# Altium schematic sheet STM32H7_POWER_MISCELLANEOUS.SchDoc
size A; Organization: Altium Limited; Address1: L3, 12a Rodborough Rd; Address2: Frenchs Forest; Address3: NSW; Address4: Australia 2086
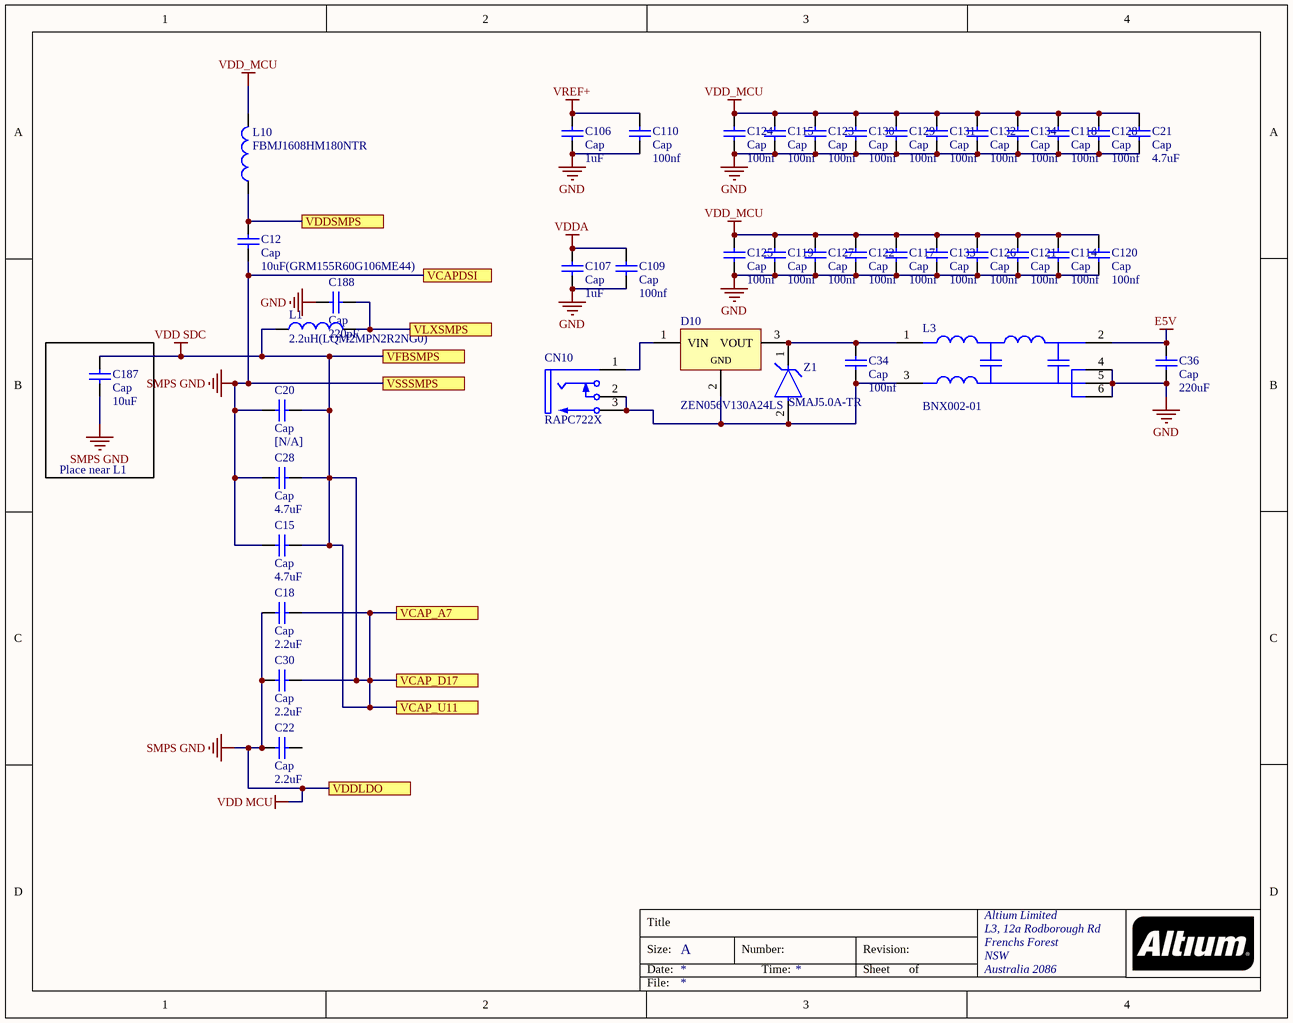
[diagram p0: STM32H7_POWER_MISCELLANEOUS.SchDoc]

## Parts
C12  Cap  value 10uF(GRM155R60G106ME44)  [RAD-0.3]
C15  Cap  value 4.7uF  [RAD-0.3]
C18  Cap  value 2.2uF  [RAD-0.3]
C20  Cap  value [N/A]  [RAD-0.3]
C21  Cap  value 4.7uF  [RAD-0.3]
C22  Cap  value 2.2uF  [RAD-0.3]
C28  Cap  value 4.7uF  [RAD-0.3]
C30  Cap  value 2.2uF  [RAD-0.3]
C34  Cap  value 100nf  [RAD-0.3]
C36  Cap  value 220uF  [RAD-0.3]
C106  Cap  value 1uF  [RAD-0.3]
C107  Cap  value 1uF  [RAD-0.3]
C109  Cap  value 100nf  [RAD-0.3]
C110  Cap  value 100nf  [RAD-0.3]
C114  Cap  value 100nf  [RAD-0.3]
C115  Cap  value 100nf  [RAD-0.3]
C117  Cap  value 100nf  [RAD-0.3]
C118  Cap  value 100nf  [RAD-0.3]
C119  Cap  value 100nf  [RAD-0.3]
C120  Cap  value 100nf  [RAD-0.3]
C121  Cap  value 100nf  [RAD-0.3]
C122  Cap  value 100nf  [RAD-0.3]
C123  Cap  value 100nf  [RAD-0.3]
C124  Cap  value 100nf  [RAD-0.3]
C125  Cap  value 100nf  [RAD-0.3]
C126  Cap  value 100nf  [RAD-0.3]
C127  Cap  value 100nf  [RAD-0.3]
C128  Cap  value 100nf  [RAD-0.3]
C129  Cap  value 100nf  [RAD-0.3]
C130  Cap  value 100nf  [RAD-0.3]
C131  Cap  value 100nf  [RAD-0.3]
C132  Cap  value 100nf  [RAD-0.3]
C133  Cap  value 100nf  [RAD-0.3]
C134  Cap  value 100nf  [RAD-0.3]
C187  Cap  value 10uF  [RAD-0.3]
C188  Cap  value 220pF  [RAD-0.3]
CN10  RAPC722X  [SWITCH-RAPC712X-3_V]
D10  ZEN056V130A24LS  [TECO-ZEN056V130A24LS_V]
L1  2.2uH(LQM2MPN2R2NG0)  [0402-A]
L3  BNX002-01  [MURA-BNX002-6]
L10  FBMJ1608HM180NTR  [0402-A]
Z1  SMAJ5.0A-TR  [FP-SMA-MFG]

## Blocks framed on the sheet
Place near L1: C187

## Ports
VCAP_A7, VCAP_D17, VCAP_U11, VCAPDSI, VDDLDO, VDDSMPS, VFBSMPS, VLXSMPS, VSSSMPS

## Nets
E5V: C36.2 L3.2(CB)
GND: C21.1 C36.1 C106.1 C107.1 C109.1 C110.1 C114.1 C115.1 C117.1 C118.1 C119.1 C120.1 C121.1 C122.1 C123.1 C124.1 C125.1 C126.1 C127.1 C128.1 C129.1 C130.1 C131.1 C132.1 C133.1 C134.1 C188.1 L3.4(CG) L3.5(CG) L3.6(CG)
SMPS GND: C12.1 C15.1 C18.1 C20.1 C22.1 C28.1 C30.1 C187.1 ; port VCAPDSI, port VDDLDO, port VSSSMPS  [also labelled VDD MCU]
VDD SDC: C15.2 C18.2 C20.2 C28.2 C30.2 C187.2 L1.1 ; port VFBSMPS, port VCAP_A7, port VCAP_D17, port VCAP_U11
VDD_MCU: C21.2 C114.2 C115.2 C117.2 C118.2 C119.2 C120.2 C121.2 C122.2 C123.2 C124.2 C125.2 C126.2 C127.2 C128.2 C129.2 C130.2 C131.2 C132.2 C133.2 C134.2 L10.2
VDDA: C107.2 C109.2
VREF+: C106.2 C110.2
VDDSMPS: C12.2 L10.1 ; port VDDSMPS
VLXSMPS: C188.2 L1.2 ; port VLXSMPS
NetC34_1: C34.1 CN10.2 CN10.3 D10.2(GND) L3.3(PSG) Z1.2(A)
NetC34_2: C34.2 D10.3(VOUT) L3.1(B) Z1.1(K)
NetCN10_1: CN10.1 D10.1(VIN)

Not connected (* = marked no-connect by the designer): C22 2

## Notes on the sheet
- Title
- Size:
- Date:
- A
- Number:
- Time:
- Revision:
- Sheet
- of
- File:

## Library data of the parts
C12 C15 C18 C20-C22 C28 C30 C34 C36 C106 C107 C109 C110 C114 C115 C117-C134 C187 C188 = Cap: Capacitor; Published: 8-Jun-2000; LatestRevisionDate: 17-Jul-2002; LatestRevisionNote: Re-released for DXP Platform.; PackageReference: RAD-0.3; Publisher: Altium Limited; PackageDescription: Radial Cap, Thru-Hole; 2 Leads; 0.3 in Pin Spacing
CN10 = CMP-2000-05384-1: Power Jack, 5 A, 3-Pin THD, RoHS, Bulk; Manufacturer: Switchcraft; Current Rating: 5A; Plug/Mating Plug Diameter: 2.1mmID,5.5mmOD; Gender: Male; Mating Products: S765-ND / -CONNPLUGMINIPWR2CONDWHT/RED / S760K-ND / -CONNPOWERPLUGMINI.08"BLACK / SC1052-ND / -CONNPOWERPLUGMINIBLACK; Number of Positions/Contacts: 2Conductors,2Contacts; Internal Switch(s): SingleSwitch,NormallyClosed; Shielding: Unshielded; Catalog Drawings: RAPC7(1,2)2XSide / RAPC7(1,2)2XTop; Dynamic Catalog: SwitchcraftInc; Other Names: Q2287470A / RAPC722X-ND / SC1313; Standard Package: 2,500; Termination: SolderEyelet(s); Family: Barrel-PowerConnectors; Housing Color: Black; Housing Material: Thermoplastic; RoHS Information: SwitchcraftRoHSInfo; Color: Black; Contact Material - Plating: Nickel; Mounting Type: ThroughHole,RightAngle; Manufacturer URL: http://www.switchcraft.com/; Contact Material: Brass; Datasheet Version: Rev. A, 08/2005; Connector Type: Jack; Category: Connectors,Interconnects; Datasheet URL: http://www.mouser.com/ds/2/393/rapc722x_cd-371352.pdf
D10 = CMP-2000-07426-1: Polymer Enhanced Zener Diode Micro-Assembly, 5.45 to 5.75 V, -40 to 85 degC, 3-Pin SMD, RoHS, Tape and Reel; Manufacturer: TE Connectivity; Zener Test Current: 100mA; Zener Voltage (Typ): 5.6V; Product Depth (mm): 4.15(Max)mm; Product Height (mm): 2mm; Knee Impedance: 0.16Ohm; Capacitance Value: 4200pF(Typ); ESD Protection Voltage: 15KV@HBM; Power Dissipation: 30000mW; Configuration: Single; Voltage Tolerance: 3%; Rad Hardened: No; Operating Temperature Max Deg. C: 85C; Package Reference: ZEN056V130A24LS; Datasheet Version: Rev. F, 05/2011; Packaging: TapeandReel; Mounting Style: SurfaceMount; Mounting: SurfaceMount; Operating Temp Range: -40Cto85C; Product Length (mm): 4.15(Max)mm; Pin Count: 3; Operating Temperature Min Deg. C: -40C; Operating Temperature Classification: Industrial; Suppressor Type: Polymer; Zener Voltage: 5.6V; Manufacturer URL: http://www.te.com/; Package Description: 3-Pin Surface Mount Device, Body 4 x 4 mm; Mounting Technology: SurfaceMount; Datasheet URL: https://datasheet.ciiva.com/361/eng-ss-scd26730-f-361409.pdf
L1 L10 = Inductor: Code_IEC: 1005; Published: 8-Jun-2000; LatestRevisionDate: 29-May-2009; LatestRevisionNote: IPC-7351 Footprint Added.; PackageReference: 0402-A; Publisher: Altium Limited; PackageDescription: Chip Inductor; Code_JEITA: 0402
L3 = CMP-2000-05262-1: MURATA BNX002-01 FILTER, POWER, EMI, 10A; Product Length (mm): 12mm; Voltage Rating Max: 50VDC; Product Depth (mm): 11mm; Product Height (mm): 13mm; Datasheet URL: http://www.murata.com/en-us/products/productdata/8796779053086/ENFH0004.pdf?1441769419000; Termination: PCPins; Mounting Style: ThroughHole; Manufacturer: Murata; Manufacturer URL: http://www.murata.com/; Current Rating (Max): 10A; Package Reference: BNX002; Package Description: 6-Pin Through Hole Device, Body 11 x 12 mm; Datasheet Version: Jul-14
Z1 = CMP-12225-000048-1: TVS DIODE 5V 13.4V SMA; Manufacturer: STMicroelectronics; Standoff Height: 0.05mm; Max Junction Temp: +150°C; Clamping Voltage: 9.2V; Number Of Channels: 1; Description: 13.4V Clamp 174A (8/20µs) Ipp Tvs Diode Surface Mount SMA (DO-214AC); Peak Pulse Power: 400W; Peak Pulse Current: 43.5A; Breakdown Voltage: 6.4V; Direction: Unidirectional; ComponentLink2Description: Datasheet; Lead Free: Yes; Package: SMA; Height: 2.65mm; Mouser Description: Transient Voltage Suppressor, TVS, Transil SMAJ Series, Unidirectional, 5 V, DO-214AC, 2, 6.4 V; Manufacturer Part Number: SMAJ5.0A-TR; Reverse Standoff Voltage: 5V; Temperature Range Low: -55°C; Device Class L1: Circuit Protection; RoHS: TRUE; Category: Diode; Automotive: No; ComponentLink2URL: https://www.st.com/resource/en/datasheet/smaj.pdf; Device Class L3: unset; Device Class L2: TVS Diodes; Temperature Range High: +150°C; Octopart: https://octopart.com/smaj5.0a-tr-stmicroelectronics-347063; Digikey Description: TVS DIODE 5V 13.4V SMA; Temperature: -55°C to +150°C